# Altium schematic sheet MCO23S17.SchDoc
size A4
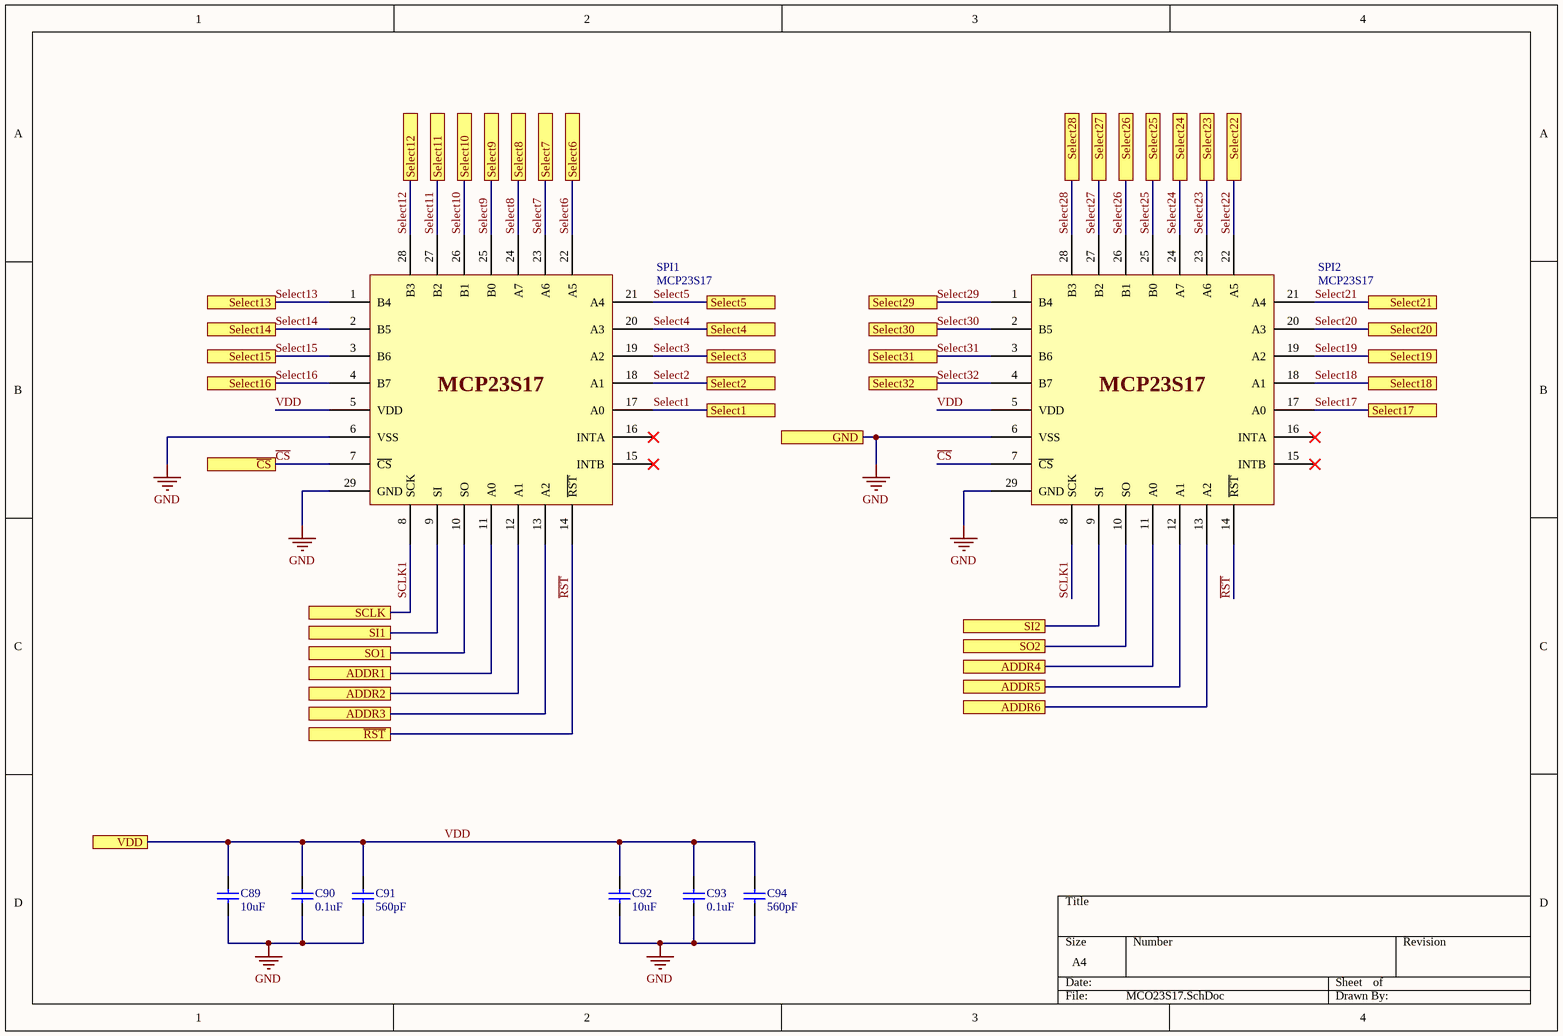
[diagram p0: MCO23S17.SchDoc]

## Parts
C89  10uF  [C0805]
C90  0.1uF  [C0805]
C91  560pF  [C0805]
C92  10uF  [C0805]
C93  0.1uF  [C0805]
C94  560pF  [C0805]
SPI1  MCP23S17  [MCP23S17]
SPI2  MCP23S17  [MCP23S17]

## Ports
ADDR1, ADDR2, ADDR3, ADDR4, ADDR5, ADDR6, GND, SCLK, Select1, Select2, Select3, Select4, Select5, Select6, Select7, Select8, Select9, Select10, Select11, Select12, Select13, Select14, Select15, Select16, Select17, Select18, Select19, Select20, Select21, Select22, Select23, Select24, Select25, Select26, Select27, Select28, Select29, Select30, Select31, Select32, SI1, SI2, SO1, SO2, VDD, ~{CS}, ~{RST}

## Nets
GND: C89.1 C90.1 C91.1 C92.1 C93.1 C94.1 SPI1.6(VSS) SPI1.29(GND) SPI2.6(VSS) SPI2.29(GND) ; port GND
ADDR1: SPI1.11(A0) ; port ADDR1
ADDR2: SPI1.12(A1) ; port ADDR2
ADDR3: SPI1.13(A2) ; port ADDR3
ADDR4: SPI2.11(A0) ; port ADDR4
ADDR5: SPI2.12(A1) ; port ADDR5
ADDR6: SPI2.13(A2) ; port ADDR6
~{CS}: SPI1.7(~{CS}) SPI2.7(~{CS}) ; port ~{CS}
~{RST}: SPI1.14(~{RST}) SPI2.14(~{RST}) ; port ~{RST}
SCLK1: SPI1.8(SCK) SPI2.8(SCK) ; port SCLK
Select1: SPI1.17(A0) ; port Select1
Select2: SPI1.18(A1) ; port Select2
Select3: SPI1.19(A2) ; port Select3
Select4: SPI1.20(A3) ; port Select4
Select5: SPI1.21(A4) ; port Select5
Select6: SPI1.22(A5) ; port Select6
Select7: SPI1.23(A6) ; port Select7
Select8: SPI1.24(A7) ; port Select8
Select9: SPI1.25(B0) ; port Select9
Select10: SPI1.26(B1) ; port Select10
Select11: SPI1.27(B2) ; port Select11
Select12: SPI1.28(B3) ; port Select12
Select13: SPI1.1(B4) ; port Select13
Select14: SPI1.2(B5) ; port Select14
Select15: SPI1.3(B6) ; port Select15
Select16: SPI1.4(B7) ; port Select16
Select17: SPI2.17(A0) ; port Select17
Select18: SPI2.18(A1) ; port Select18
Select19: SPI2.19(A2) ; port Select19
Select20: SPI2.20(A3) ; port Select20
Select21: SPI2.21(A4) ; port Select21
Select22: SPI2.22(A5) ; port Select22
Select23: SPI2.23(A6) ; port Select23
Select24: SPI2.24(A7) ; port Select24
Select25: SPI2.25(B0) ; port Select25
Select26: SPI2.26(B1) ; port Select26
Select27: SPI2.27(B2) ; port Select27
Select28: SPI2.28(B3) ; port Select28
Select29: SPI2.1(B4) ; port Select29
Select30: SPI2.2(B5) ; port Select30
Select31: SPI2.3(B6) ; port Select31
Select32: SPI2.4(B7) ; port Select32
SI1: SPI1.9(SI) ; port SI1
SI2: SPI2.9(SI) ; port SI2
SO1: SPI1.10(SO) ; port SO1
SO2: SPI2.10(SO) ; port SO2
VDD: C89.2 C90.2 C91.2 C92.2 C93.2 C94.2 SPI1.5(VDD) SPI2.5(VDD) ; port VDD

Not connected (* = marked no-connect by the designer): SPI1 15(INTB)* 16(INTA)*; SPI2 15(INTB)* 16(INTA)*

## Library data of the parts
C89 C92 = Cap 10uF: Manufacturer: Taiyo Yuden; Manufacturer Part Number: UMK212SD103KD-T; Dielectric Material: Ceramic; Capacitance: 10nF; Tolerance: 10%; Voltage Rating: 50V; Supplier 1: Digi-Key; Stock 1: 14125; Pricing 1: 1=0.47, 10=0.323, 100=0.1941, 500=0.1455, 1000=0.1229 (USD); Mount: Surface Mount; Case/Package: 0805; Number of Pins: 2; Case Code (Metric): 2012; Case Code (Imperial): 0805; Min Operating Temperature: -55°C; Max Operating Temperature: 125°C; Packaging: Tape and Reel; Package Quantity: 1; Voltage Rating (DC): 50V; Termination: SMD/SMT; Length: 2mm; Height: 0.85mm; Width: 0.049inch; Thickness: 0.037inch; Depth: 1.25mm; Radiation Hardening: No; Lead Free: Lead Free; Halogen Free: Halogen Free; ComponentLink1URL: https://datasheet.ciiva.com/138/umk212sd103kd-t-ss-138661.pdf; ComponentLink1Description: https://datasheet.ciiva.com/138/umk212sd103kd-t-ss-138661.pdf; ComponentLink2URL: https://datasheet.ciiva.com/138/mlcc07-e-138662.pdf; ComponentLink2Description: https://datasheet.ciiva.com/138/mlcc07-e-138662.pdf; ComponentLink3URL: https://datasheet.ciiva.com/138/mlcc07-e-138663.pdf; ComponentLink3Description: https://datasheet.ciiva.com/138/mlcc07-e-138663.pdf; ComponentLink4URL: https://datasheet.ciiva.com/30140/303umk212sd103kd-t-30140925.pdf; ComponentLink4Description: https://datasheet.ciiva.com/30140/303umk212sd103kd-t-30140925.pdf; Supplier Part Number 1: 587-1114-1-ND
C90 C93 = Cap 0.1uF: Manufacturer: Taiyo Yuden; Manufacturer Part Number: UMK212SD103KD-T; Dielectric Material: Ceramic; Capacitance: 10nF; Tolerance: 10%; Voltage Rating: 50V; Supplier 1: Digi-Key; Stock 1: 14125; Pricing 1: 1=0.47, 10=0.323, 100=0.1941, 500=0.1455, 1000=0.1229 (USD); Mount: Surface Mount; Case/Package: 0805; Number of Pins: 2; Case Code (Metric): 2012; Case Code (Imperial): 0805; Min Operating Temperature: -55°C; Max Operating Temperature: 125°C; Packaging: Tape and Reel; Package Quantity: 1; Voltage Rating (DC): 50V; Termination: SMD/SMT; Length: 2mm; Height: 0.85mm; Width: 0.049inch; Thickness: 0.037inch; Depth: 1.25mm; Radiation Hardening: No; Lead Free: Lead Free; Halogen Free: Halogen Free; ComponentLink1URL: https://datasheet.ciiva.com/138/umk212sd103kd-t-ss-138661.pdf; ComponentLink1Description: https://datasheet.ciiva.com/138/umk212sd103kd-t-ss-138661.pdf; ComponentLink2URL: https://datasheet.ciiva.com/138/mlcc07-e-138662.pdf; ComponentLink2Description: https://datasheet.ciiva.com/138/mlcc07-e-138662.pdf; ComponentLink3URL: https://datasheet.ciiva.com/138/mlcc07-e-138663.pdf; ComponentLink3Description: https://datasheet.ciiva.com/138/mlcc07-e-138663.pdf; ComponentLink4URL: https://datasheet.ciiva.com/30140/303umk212sd103kd-t-30140925.pdf; ComponentLink4Description: https://datasheet.ciiva.com/30140/303umk212sd103kd-t-30140925.pdf; Supplier Part Number 1: 587-1114-1-ND
C91 C94 = Cap 560pF: Manufacturer: Taiyo Yuden; Manufacturer Part Number: UMK212SD103KD-T; Dielectric Material: Ceramic; Capacitance: 10nF; Tolerance: 10%; Voltage Rating: 50V; Stock 1: 14125; Pricing 1: 1=0.47, 10=0.323, 100=0.1941, 500=0.1455, 1000=0.1229 (USD); Mount: Surface Mount; Case/Package: 0805; Number of Pins: 2; Case Code (Metric): 2012; Case Code (Imperial): 0805; Min Operating Temperature: -55°C; Max Operating Temperature: 125°C; Packaging: Tape and Reel; Package Quantity: 1; Voltage Rating (DC): 50V; Termination: SMD/SMT; Length: 2mm; Height: 0.85mm; Width: 0.049inch; Thickness: 0.037inch; Depth: 1.25mm; Radiation Hardening: No; Lead Free: Lead Free; Halogen Free: Halogen Free; ComponentLink1URL: https://datasheet.ciiva.com/138/umk212sd103kd-t-ss-138661.pdf; ComponentLink1Description: https://datasheet.ciiva.com/138/umk212sd103kd-t-ss-138661.pdf; ComponentLink2URL: https://datasheet.ciiva.com/138/mlcc07-e-138662.pdf; ComponentLink2Description: https://datasheet.ciiva.com/138/mlcc07-e-138662.pdf; ComponentLink3URL: https://datasheet.ciiva.com/138/mlcc07-e-138663.pdf; ComponentLink3Description: https://datasheet.ciiva.com/138/mlcc07-e-138663.pdf; ComponentLink4URL: https://datasheet.ciiva.com/30140/303umk212sd103kd-t-30140925.pdf; ComponentLink4Description: https://datasheet.ciiva.com/30140/303umk212sd103kd-t-30140925.pdf; Supplier 1: Digi-Key; Supplier Part Number 1: 311-1120-1-ND
SPI1 SPI2 = MCP23S17: 16b IO Expander with SPI